# Altium schematic sheet Power.SchDoc
size 420 x 297 mm; DocumentNumber: Power supply
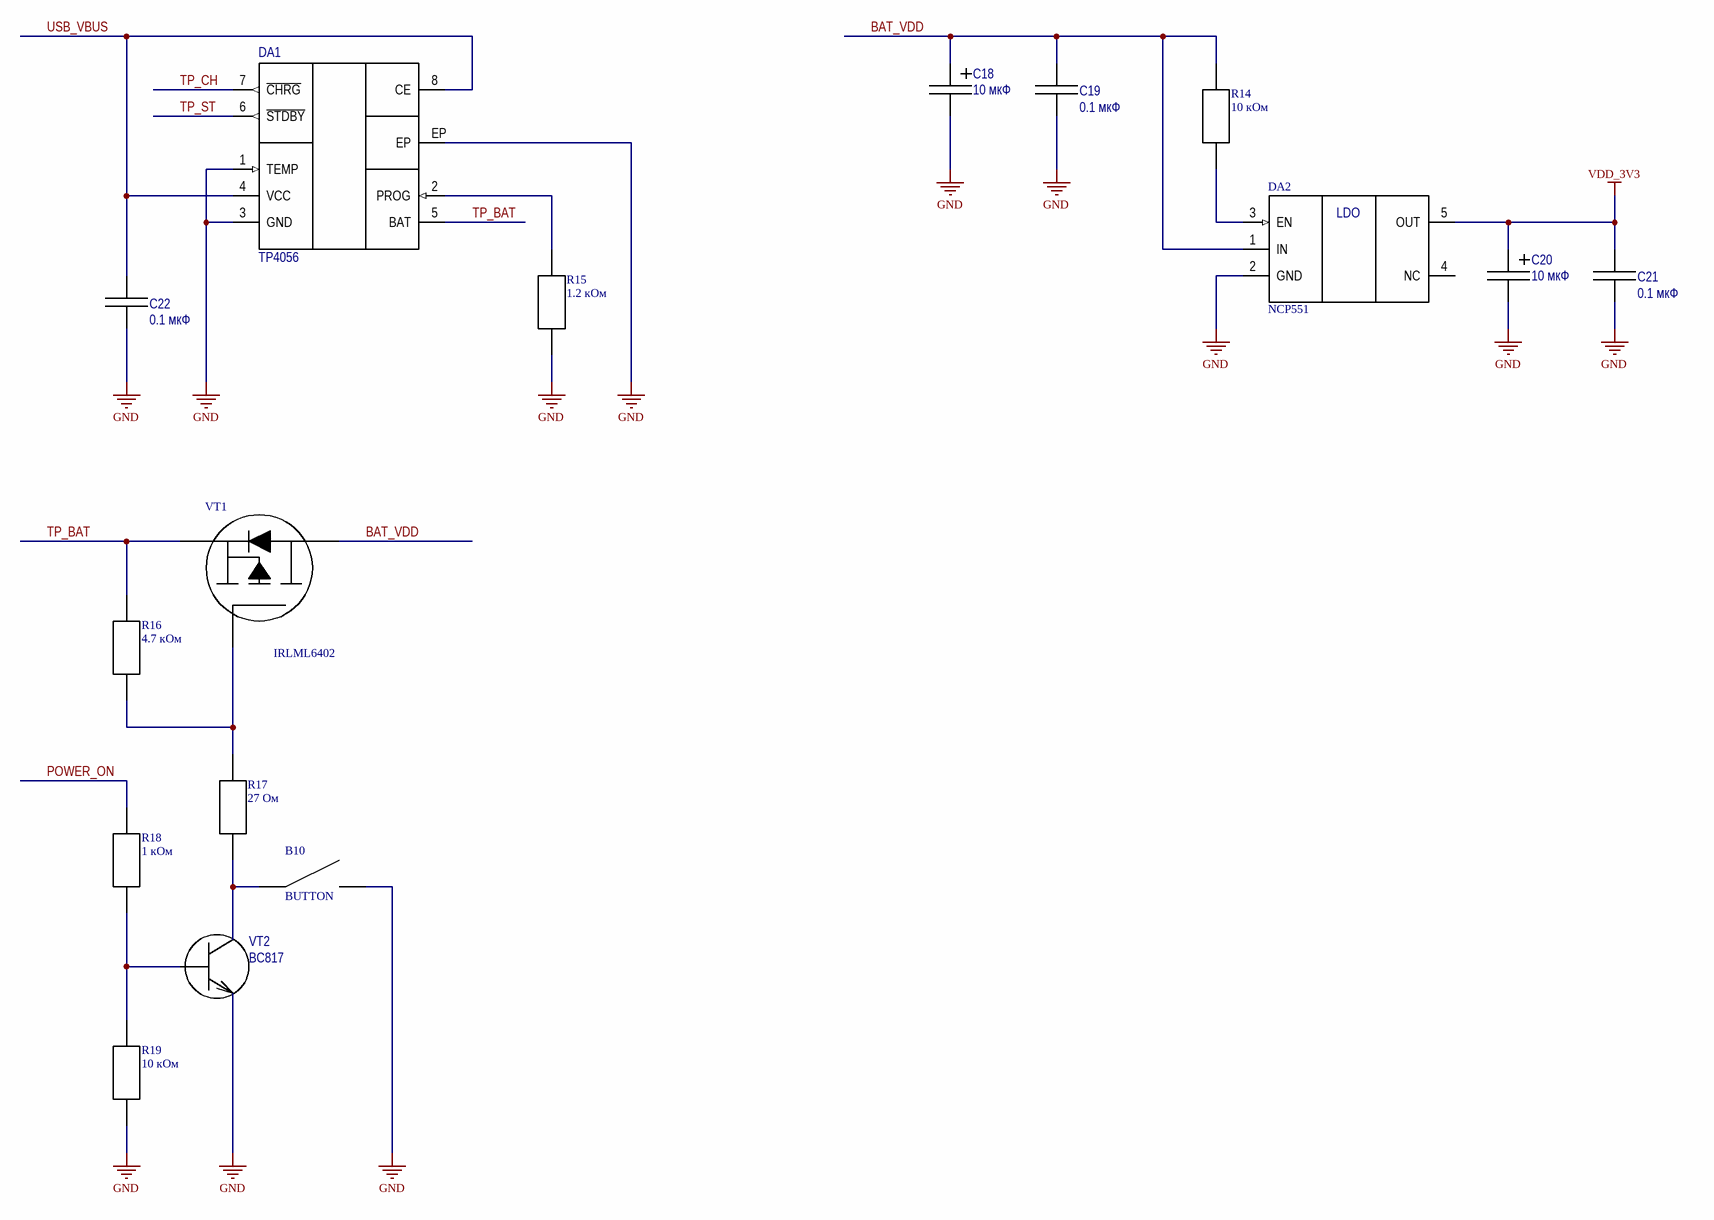
[diagram p0: Power.SchDoc]

## Parts
B10  BUTTON  [TACT SKHH Horizontal Switch]
C18  10 мкФ  [C TAN_A]
C19  0.1 мкФ  [C 0805]
C20  10 мкФ  [C TAN_A]
C21  0.1 мкФ  [C 0805]
C22  0.1 мкФ  [C 0805]
DA1  TP4056  [HSOP-8]
DA2  NCP551  [TSOP-5]
R14  10 кОм  [RES 0402]
R15  1.2 кОм  [RES 0402]
R16  4.7 кОм  [RES 0402]
R17  27 Ом  [RES 0402]
R18  1 кОм  [RES 0402]
R19  10 кОм  [RES 0402]
VT1  IRLML6402  [SOT-23]
VT2  BC817  [SOT-23]

## Nets
GND: B10.2 C18.2 C19.1 C20.2 C21.1 C22.1 DA1.1(TEMP) DA1.3(GND) DA1.EP DA2.2(GND) R15.1 R19.1 VT2.2(E)
VDD_3V3: C20.1 C21.2 DA2.5(OUT)
BAT_VDD: C18.1 C19.2 DA2.1(IN) R14.2 VT1.3(D)
POWER_ON: R18.2
TP_BAT: DA1.5(BAT) R16.2 VT1.2(S)
TP_CH: DA1.7(~{CHRG})
TP_ST: DA1.6(~{STDBY})
USB_VBUS: C22.2 DA1.4(VCC) DA1.8(CE)
NetB10_1: B10.1 R17.1 VT2.3(C)
NetDA1_2: DA1.2(PROG) R15.2
NetDA2_3: DA2.3(EN) R14.1
NetR16_1: R16.1 R17.2 VT1.1(G)
NetR18_1: R18.1 R19.2 VT2.1(B)

Not connected (* = marked no-connect by the designer): DA2 4(NC)

## Notes on the sheet
- Подп. и дата
- Инв. № дубл.
- Взам. инв. №
- Инв. № подл.
- Лист
- Изм.
- № докум.
- Подп.
- Дата
- Копировал
- Формат А3
- (in symbol NCP551) LDO

## Library data of the parts
C18 C20 = CAP TAN_A: SMD Tantalium Capacitor A; Type: Конденсатор танталовый; Size: A
C19 C21 C22 = CAP 0805: SMD Capacitor 0805; Type: Конденсатор керамический; Size: 0805; Value: 0.1 мкФ
R14-R19 = RES 0402
VT2 = BC817: NPN general-purpose transistor; Manufacturer: NXP; Structure: n-p-n; Type: Транзистор биполярный; hFE: 160 ... 600; Max collector-emitter voltage: 45 В; Max collector-base voltage: 50 В; Max emitter-base voltage: 5 В; Max collector current: 0,5 А; Max collector peak current: 1 А; Power dissitipation: 0,25 Вт; fT: 100 МГц; Collector-emitter saturation voltage: 0,7 В; Base-emitter on voltage: 1,2 В; Specitication: ЭКБ ИП; Collector-base сapacitance: 3 пФ; Complement: BC807; Temperature range: -65 ... 150 °C